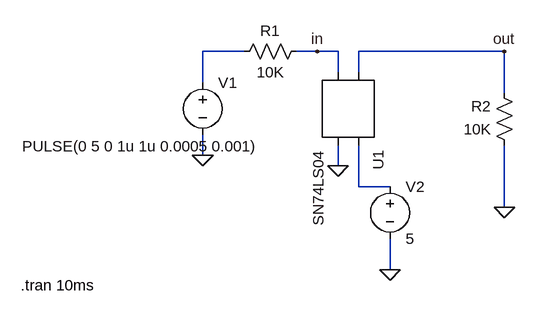
[diagram p0: schematic simulacionSN74LS04.asc]
simulacionSN74LS04.asc, the LTspice schematic file:
Version 4
SHEET 1 880 680
WIRE 48 144 -16 144
WIRE 160 144 128 144
WIRE 192 144 160 144
WIRE 448 144 224 144
WIRE 192 176 192 144
WIRE 224 176 224 144
WIRE -16 192 -16 144
WIRE 448 208 448 144
WIRE -16 304 -16 272
WIRE 192 320 192 288
WIRE 224 352 224 288
WIRE 272 352 224 352
WIRE 448 384 448 288
WIRE 272 480 272 432
FLAG -16 304 0
FLAG 192 320 0
FLAG 272 480 0
FLAG 448 384 0
FLAG 160 144 in
FLAG 448 144 out
SYMBOL AutoGenerated\\SN74LS04 208 224 R90
SYMATTR InstName U1
SYMBOL voltage -16 176 R0
WINDOW 3 -278 114 Left 2
WINDOW 123 0 0 Left 0
WINDOW 39 0 0 Left 0
SYMATTR Value PULSE(0 5 0 1u 1u 0.0005 0.001)
SYMATTR InstName V1
SYMBOL voltage 272 336 R0
WINDOW 123 0 0 Left 0
WINDOW 39 0 0 Left 0
SYMATTR InstName V2
SYMATTR Value 5
SYMBOL res 144 128 R90
WINDOW 0 0 56 VBottom 2
WINDOW 3 32 56 VTop 2
SYMATTR InstName R1
SYMATTR Value 10K
SYMBOL res 464 304 R180
WINDOW 0 36 76 Left 2
WINDOW 3 36 40 Left 2
SYMATTR InstName R2
SYMATTR Value 10K
TEXT -296 504 Left 2 !.tran 10ms

The netlist it stands for:
* simulacionSN74LS04.asc
* U1: SN74LS04 (symbol AutoGenerated\SN74LS04 not available, pins judged from their places): pin1=out pin2=in pin3=N002 pin4=0
V1 N001 0 PULSE(0 5 0 1u 1u 0.0005 0.001)
V2 N002 0 5
R1 in N001 10K
R2 0 out 10K
.tran 10ms
.backanno
.end